# EAGLE design 1ChAmp_circuit_TH (EAGLE 7.3.0)
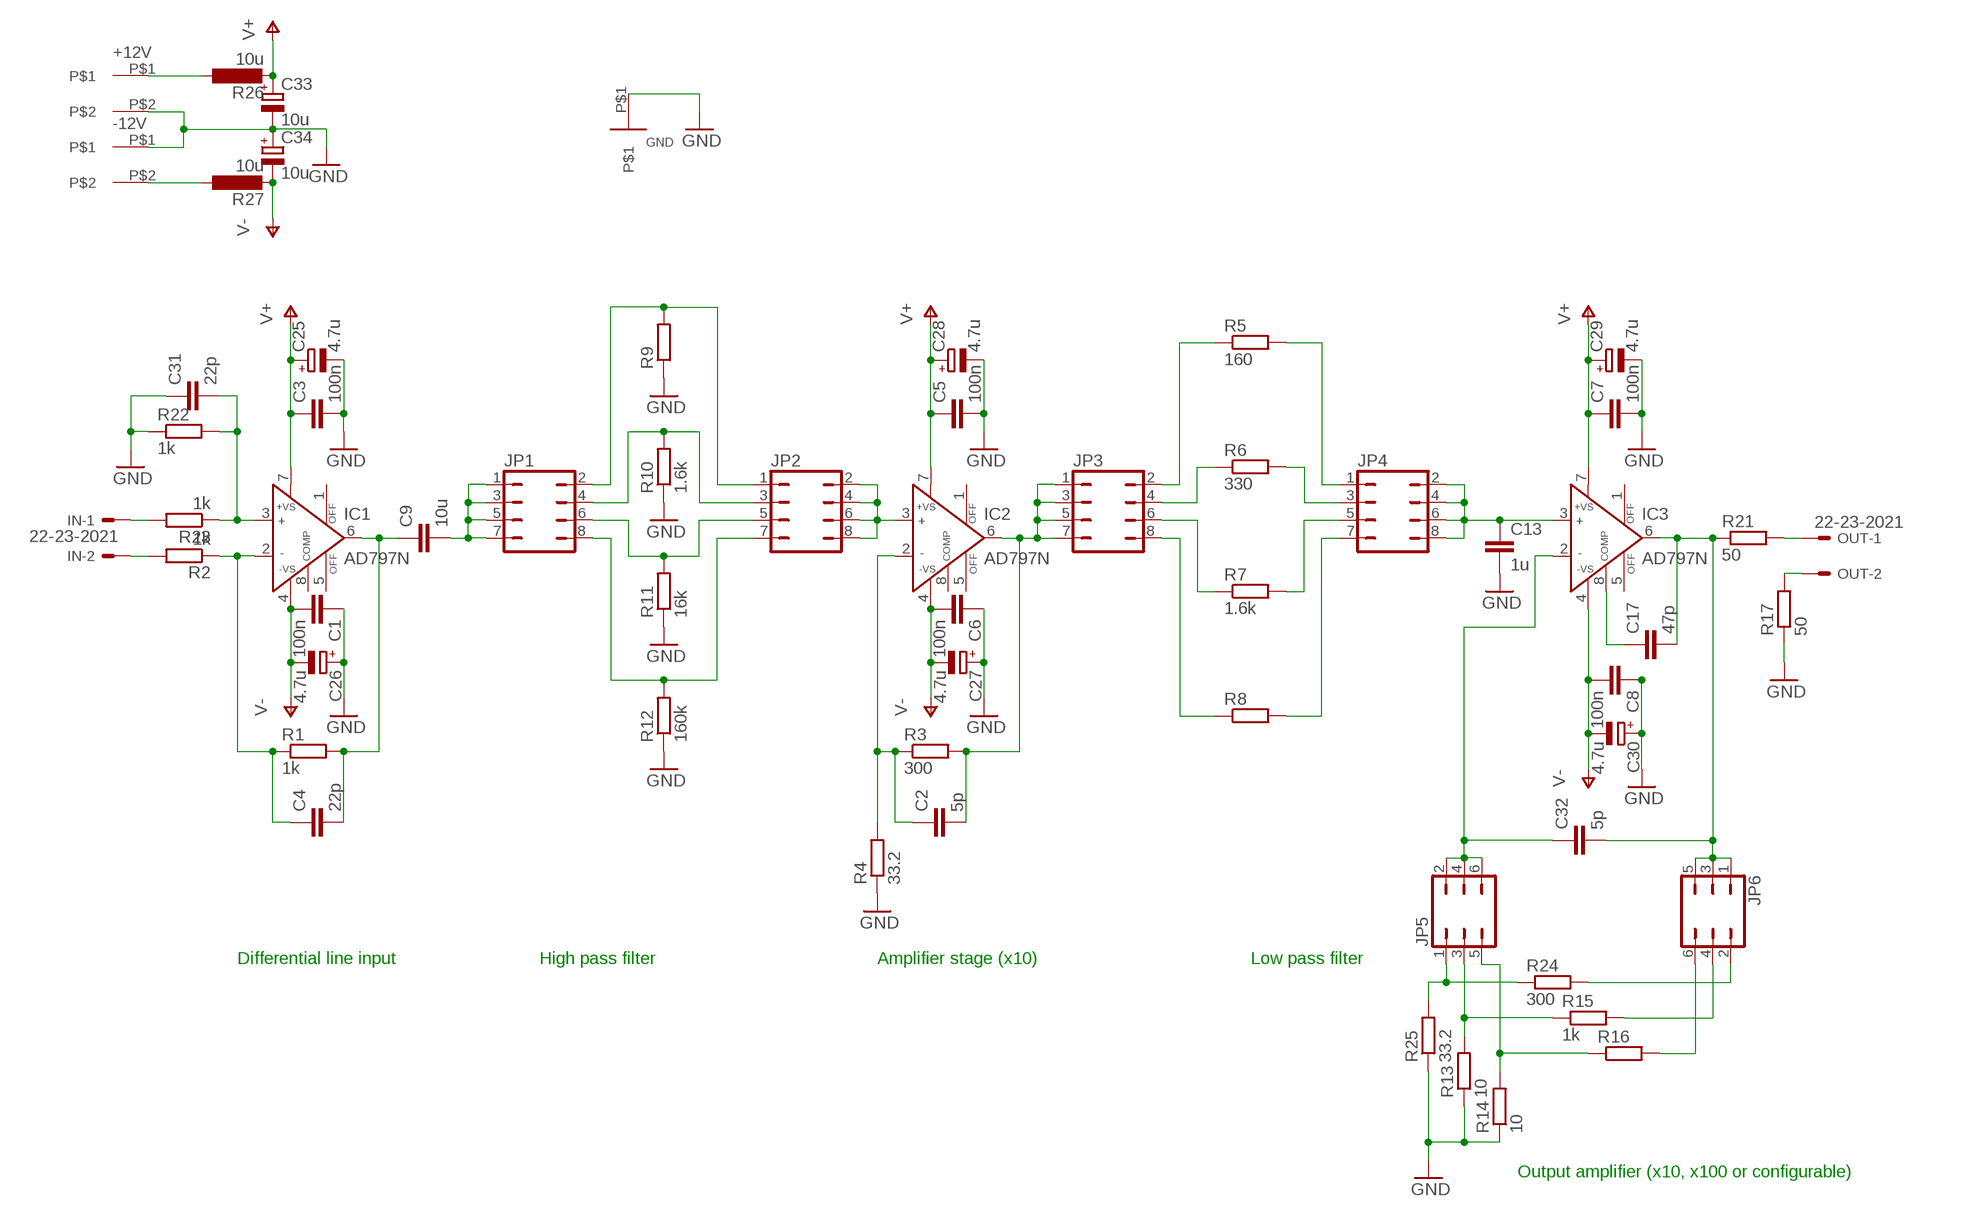
[diagram p0: schematic, sheet 1]

## Parts
+12V  B2P-VH  [B2P-VH]
-12V  B2P-VH  [B2P-VH]
C1  100n  C-EU025-025X050  [C025-025X050]
C2  5p  C-EU025-025X050  [C025-025X050]
C3  100n  C-EU025-025X050  [C025-025X050]
C4  22p  C-EU025-025X050  [C025-025X050]
C5  100n  C-EU025-025X050  [C025-025X050]
C6  100n  C-EU025-025X050  [C025-025X050]
C7  100n  C-EU025-025X050  [C025-025X050]
C8  100n  C-EU025-025X050  [C025-025X050]
C9  10u  C-EU150-091X182  [C150-091X182]
C13  1u  C-EU025-025X050  [C025-025X050]
C17  47p  C-EU025-025X050  [C025-025X050]
C25  4.7u  CPOL-EUB45181A  [B45181A]
C26  4.7u  CPOL-EUB45181A  [B45181A]
C27  4.7u  CPOL-EUB45181A  [B45181A]
C28  4.7u  CPOL-EUB45181A  [B45181A]
C29  4.7u  CPOL-EUB45181A  [B45181A]
C30  4.7u  CPOL-EUB45181A  [B45181A]
C31  22p  C-EU025-025X050  [C025-025X050]
C32  5p  C-EU050-025X075  [C050-025X075]
C33  10u  CPOL-EUB45181A  [B45181A]
C34  10u  CPOL-EUB45181A  [B45181A]
GND  GND_CONNECTOR  [GND_CONNECTOR]
IC1  AD797N  [DIL08]
IC2  AD797N  [DIL08]
IC3  AD797N  [DIL08]
IN  22-23-2021  [22-23-2021]
JP1  JP4Q  [JP4Q]
JP2  JP4Q  [JP4Q]
JP3  JP4Q  [JP4Q]
JP4  JP4Q  [JP4Q]
JP5  JP3Q  [JP3Q]
JP6  JP3Q  [JP3Q]
OUT  22-23-2021  [22-23-2021]
R1  1k  R-EU_0204/5  [0204/5]
R2  1k  R-EU_0204/5  [0204/5]
R3  300  R-EU_0204/5  [0204/5]
R4  33.2  R-EU_0204/5  [0204/5]
R5  160  R-EU_0204/5  [0204/5]
R6  330  R-EU_0204/5  [0204/5]
R7  1.6k  R-EU_0204/5  [0204/5]
R8  R-EU_0204/5  [0204/5]
R9  R-EU_0204/5  [0204/5]
R10  1.6k  R-EU_0204/5  [0204/5]
R11  16k  R-EU_0204/5  [0204/5]
R12  160k  R-EU_0204/5  [0204/5]
R13  10  R-EU_0204/5  [0204/5]
R14  10  R-EU_0204/5  [0204/5]
R15  1k  R-EU_0204/5  [0204/5]
R16  R-EU_0204/5  [0204/5]
R17  50  R-EU_0204/5  [0204/5]
R21  50  R-EU_0204/5  [0204/5]
R22  1k  R-EU_0204/5  [0204/5]
R23  1k  R-EU_0204/5  [0204/5]
R24  300  R-EU_0204/5  [0204/5]
R25  33.2  R-EU_0204/5  [0204/5]
R26  10u  L-EU  [RFS1113]
R27  10u  L-EU  [RFS1113]

## Nets
GND: +12V.P$2 -12V.P$1 C1.1 C3.2 C5.2 C6.1 C7.2 C8.1 C13.2 C25.- C26.+ C27.+ C28.- C29.- C30.+ C31.1 C33.- C34.+ GND.P$1 R4.1 R9.1 R10.1 R11.1 R12.1 R13.1 R14.1 R17.1 R22.1 R25.1
N$1: IN.2 R2.2
N$2: OUT.1 R21.2
N$3: IN.1 R23.2
N$4: C31.2 IC1.3(IN+) R22.2 R23.1
N$5: JP5.5 R14.2 R16.1
N$6: JP4.1 R5.2
N$7: C4.1 IC1.2(IN-) R1.1 R2.1
N$8: C4.2 C9.1 IC1.6(OUT) R1.2
N$9: C2.1 IC2.2(IN-) R3.1 R4.2
N$10: C2.2 IC2.6(OUT) JP3.1 JP3.3 JP3.5 JP3.7 R3.2
N$11: JP4.3 R6.2
N$12: C17.1 IC3.8(COMP)
N$13: JP4.5 R7.2
N$14: C17.2 C32.2 IC3.6(OUT) JP6.1 JP6.3 JP6.5 R21.1
N$15: +12V.P$1 R26.P$1
N$16: JP4.7 R8.2
N$17: JP5.3 R13.2 R15.1
N$18: OUT.2 R17.2
N$19: JP5.1 R24.1 R25.2
N$21: JP6.2 R24.2
N$23: JP6.4 R15.2
N$25: JP6.6 R16.2
N$26: C32.1 IC3.2(IN-) JP5.2 JP5.4 JP5.6
N$28: C9.2 JP1.1 JP1.3 JP1.5 JP1.7
N$29: JP1.4 JP2.3 R10.2
N$30: JP1.6 JP2.5 R11.2
N$31: JP1.8 JP2.7 R12.2
N$32: IC2.3(IN+) JP2.2 JP2.4 JP2.6 JP2.8
N$33: JP3.2 R5.1
N$34: JP3.4 R6.1
N$35: JP3.6 R7.1
N$36: JP3.8 R8.1
N$37: C13.1 IC3.3(IN+) JP4.2 JP4.4 JP4.6 JP4.8
N$38: JP1.2 JP2.1 R9.2
N$40: -12V.P$2 R27.P$1
V+: C3.1 C5.1 C7.1 C25.+ C28.+ C29.+ C33.+ IC1.7(+VS) IC2.7(+VS) IC3.7(+VS) R26.P$2
V-: C1.2 C6.2 C8.2 C26.- C27.- C30.- C34.- IC1.4(-VS) IC2.4(-VS) IC3.4(-VS) R27.P$2
Unconnected: IC1.1(OFF) IC1.5(OFF) IC1.8(COMP) IC2.1(OFF) IC2.5(OFF) IC2.8(COMP) IC3.1(OFF) IC3.5(OFF)

## Notes on the sheet
- Differential line input | High pass filter | Amplifier stage (x10) | Low pass filter
- Output amplifier (x10, x100 or configurable)

## Library data of the parts
+12V -12V = con-jst:B2P-VH: 2pin connector with 3.96mm pitch
C1-C9 C13 C17 C31 C32 = rcl:C-EU: CAPACITOR, European symbol
C25-C30 C33 C34 = rcl:CPOL-EU: POLARIZED CAPACITOR, European symbol
GND = jumper:GND_CONNECTOR: Connection pad to GND; 0.8 mm hole
IC1-IC3 = analog-devices:AD797: Ultralow Distortion, Ultralow Noise Op Amp Source: http://www.analog.com/static/imported-files/data_sheets/AD797.pdf; MF: ALTERA CORPORATION; MPN: AD797ANZ; OC_FARNELL: 9603778; OC_NEWARK: 59K6088
IN OUT = con-molex:22-23-2021: .100" (2.54mm) Center Header - 2 Pin; MF: MOLEX; MPN: 22-23-2021; OC_FARNELL: 1462926; OC_NEWARK: 25C3832
JP1-JP4 = jumper:JP4Q: JUMPER
JP5 JP6 = jumper:JP3Q: JUMPER
R1-R7 R9-R17 R21-R25 = rcl:R-EU_: RESISTOR, European symbol
R8 = resistor:R-EU_: RESISTOR, European symbol
R26 R27 = rcl:L-EU: INDUCTOR, European symbol

## Board
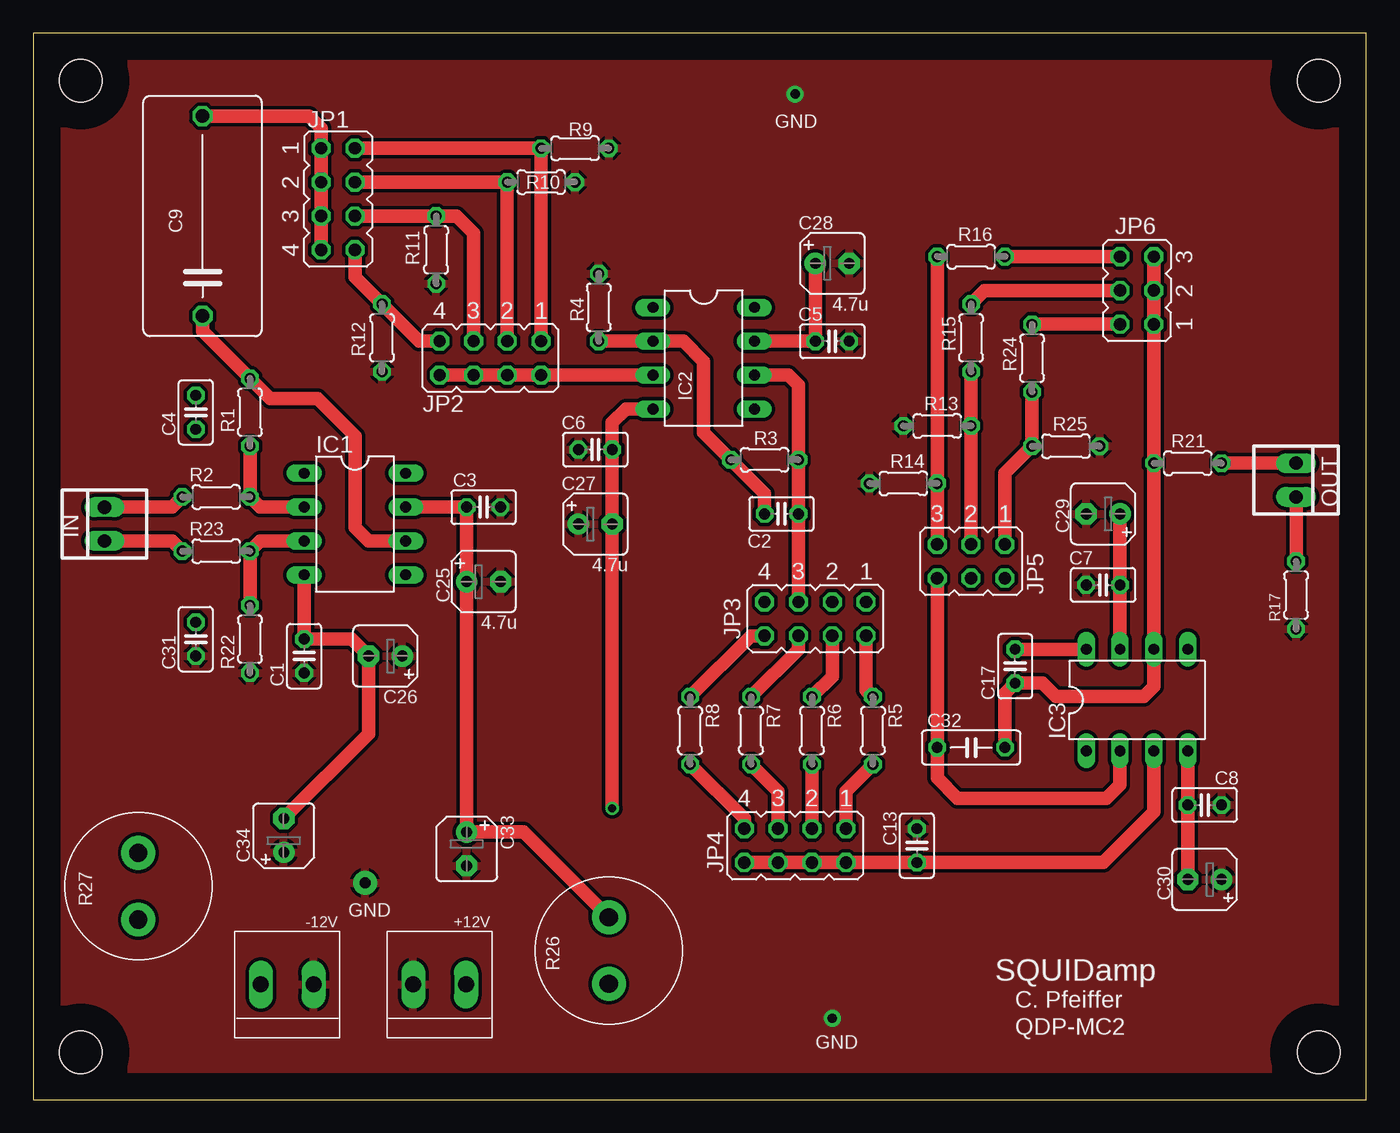
[diagram p1: board, top side]
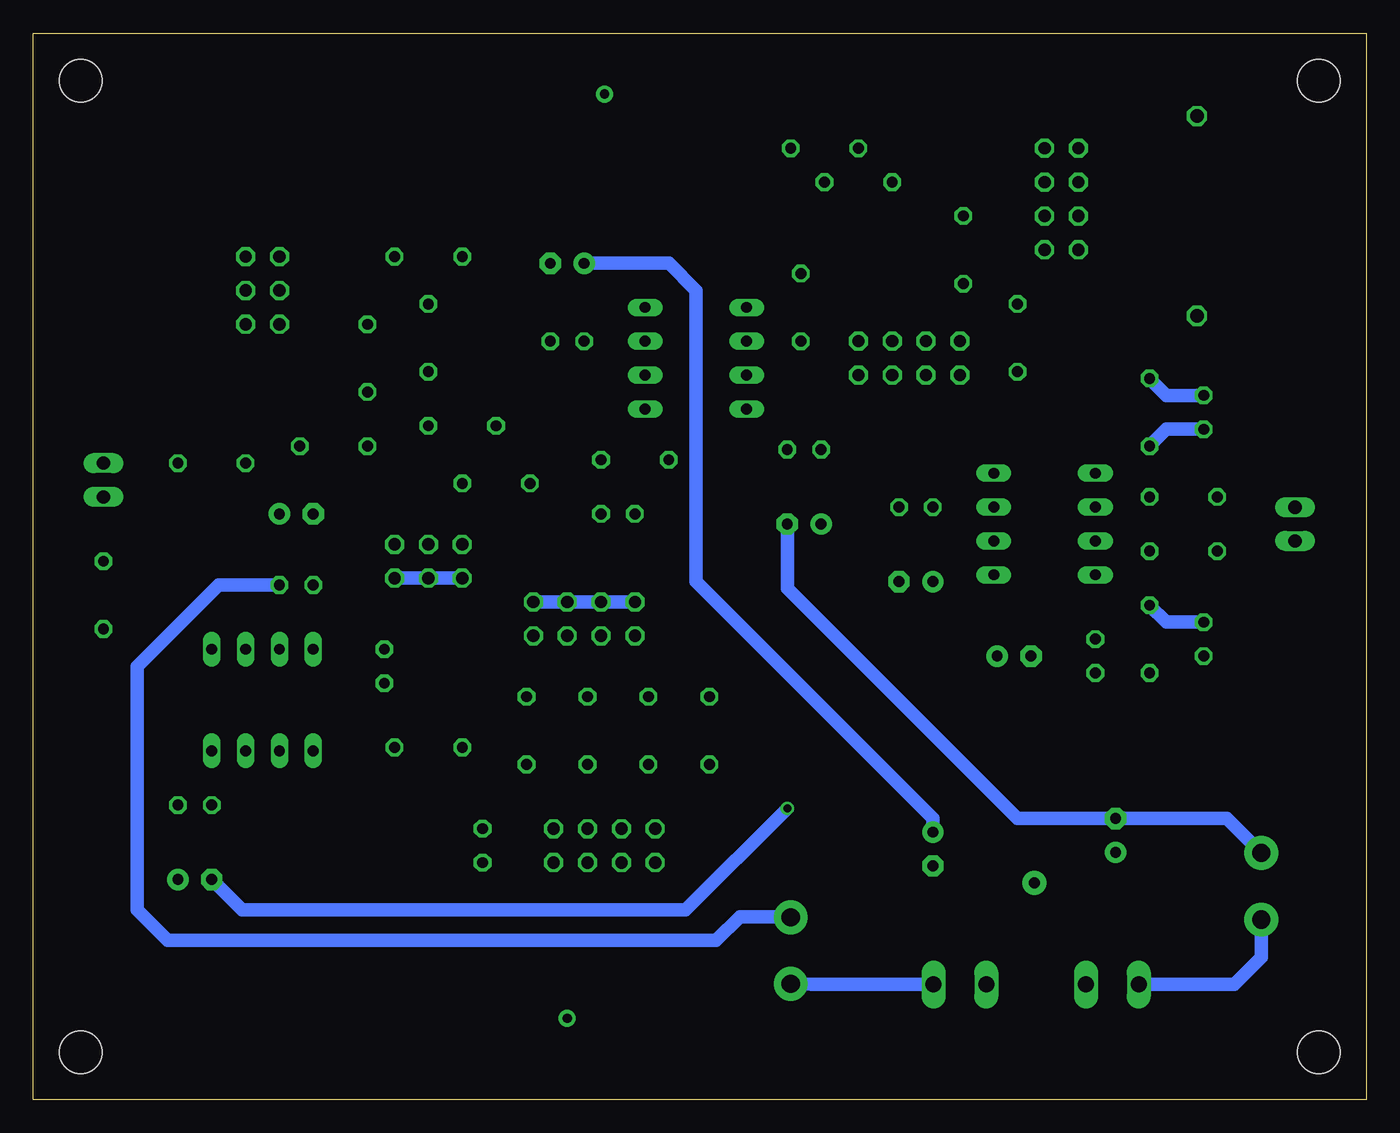
[diagram p2: board, bottom side, seen from below]

Size 100 x 80 mm. Coordinates in mm from the lower left corner, seen from the top.
Outline: 0,0 100,0 100,80 0,80 0,0
Copper layers (1*16): Top 0.035mm / dielectric 1.5mm / Bottom 0.035mm
Design rules "default *": minimum track width 6mil, minimum drill 12mil, track to track 6mil, track to pad 6mil, pad to pad 6mil, via to via 6mil, smd to smd 6mil, copper to edge 80mil, drill to drill 50mil, minimum pad ring 10mil, minimum via ring 8mil, stop-mask expansion 4mil, vias tented up to drill 0mil, thermal gap 10mil
Holes 3.2 mm at 3.56,3.56 3.56,76.44 96.44,3.56 96.44,76.44

### Footprints (pad centres in the part's own frame; a part is rotated, then mirrored left to right if it is on the bottom)
B2P-VH = drill 1.2 long: P$1 -1.98,0; P$2 1.98,0
C025-025X050 = drill 0.813 octagon: 1 -1.27,0; 2 1.27,0
C150-091X182 = drill 1.016 octagon: 1 -7.493,0; 2 7.493,0
B45181A = drill 0.813 pad 1.6: + -1.27,0 | drill 0.813 pad 1.6 octagon: - 1.27,0
C050-025X075 = drill 0.813 octagon: 1 -2.54,0; 2 2.54,0
GND_CONNECTOR = drill 0.8 pad 1.778: P$1 0,0
DIL08 = drill 0.813 long: 1 -3.81,-3.81; 2 -1.27,-3.81; 3 1.27,-3.81; 4 3.81,-3.81; 5 3.81,3.81; 6 1.27,3.81; 7 -1.27,3.81; 8 -3.81,3.81
22-23-2021 = drill 1 long: 1 -1.27,0; 2 1.27,0
JP4Q = drill 0.914 octagon: 1 -3.81,-1.27; 2 -3.81,1.27; 3 -1.27,-1.27; 4 -1.27,1.27; 5 1.27,-1.27; 6 1.27,1.27; 7 3.81,-1.27; 8 3.81,1.27
JP3Q = drill 0.914 octagon: 1 -2.54,-1.27; 2 -2.54,1.27; 3 0,-1.27; 4 0,1.27; 5 2.54,-1.27; 6 2.54,1.27
0204/5 = drill 0.813 octagon: 1 -2.54,0; 2 2.54,0
RFS1113 = drill 1.37 pad 2.54: P$1 -2.5,0; P$2 2.5,0

### Placement (x,y rotation side)
+12V  30.48,8.64 180 top
-12V  19.05,8.64 180 top
C1  20.32,33.27 90 top
C2  56.13,43.94 0 top
C3  33.78,44.45 0 top
C4  12.19,51.56 90 top
C5  59.94,56.9 0 top
C6  42.16,48.77 0 top
C7  80.26,38.61 180 top
C8  87.88,22.1 180 top
C9  12.7,66.29 90 top
C13  66.29,19.05 90 top
C17  73.66,32.51 270 top
C25  33.78,38.86 0 top
C26  26.42,33.27 180 top
C27  42.16,43.18 0 top
C28  59.94,62.74 0 top
C29  80.26,43.94 180 top
C30  87.88,16.51 180 top
C31  12.19,34.54 90 top
C32  70.36,26.42 0 top
C33  32.51,18.8 270 top
C34  18.8,19.81 90 top
GND  24.89,16.26 0 top
IC1  24.13,43.18 270 top
IC2  50.29,55.63 270 top
IC3  82.8,29.97 0 top
IN  5.33,43.18 90 top
JP1  22.86,67.56 270 top
JP2  34.29,55.63 180 top
JP3  58.67,36.07 180 top
JP4  57.15,19.05 180 top
JP5  70.36,40.39 180 top
JP6  82.8,60.71 90 top
OUT  94.74,46.48 270 top
R1  16.26,51.56 90 top
R2  13.72,45.21 180 top
R3  54.86,48.01 0 top
R4  42.42,59.44 270 top
R5  62.99,27.69 270 top
R6  58.42,27.69 270 top
R7  53.85,27.69 270 top
R8  49.28,27.69 270 top
R9  40.64,71.37 180 top
R10  38.1,68.83 180 top
R11  30.23,63.75 90 top
R12  26.16,57.15 90 top
R13  67.82,50.55 0 top
R14  65.28,46.23 0 top
R15  70.36,57.15 90 top
R16  70.36,63.25 0 top
R17  94.74,37.85 90 top
R21  86.61,47.75 0 top
R22  16.26,34.54 90 top
R23  13.72,41.15 180 top
R24  74.93,55.63 90 top
R25  77.47,49.02 180 top
R26  43.18,11.18 90 top
R27  7.87,16 90 top

### Tracks (layer width: path | path; a pad name or v marks a point on that pad's centre or on a via)
GND  (via drill 0.7 pad 1.27)
  other vias: 57.15,75.44 59.94,6.1
  pour Top (isolate 0.254): 0,80 0,0 100,0 100,80
N$1
  Top 1.016: R2.2 10.41,44.45 IN.2
N$2
  Top 1.016: R21.2 OUT.1
N$3
  Top 1.016: R23.2 10.41,41.91 IN.1
N$4
  Top 1.016: IC1.3 17.02,41.91 R23.1 R22.2
  Bottom 1.016: R22.2 14.99,35.81 C31.2
N$5
  Top 1.016: JP5.5 R14.2 R16.1
N$6
  Top 1.016: JP4.1 60.96,23.11 R5.2
N$7
  Top 1.016: IC1.2 17.02,44.45 R2.1 R1.1
  Bottom 1.016: R1.1 14.99,50.29 C4.1
N$8
  Top 1.016: IC1.6 25.15,41.91 24.13,42.93 24.13,49.78 21.34,52.58 17.78,52.58 R1.2 12.7,57.66 C9.1
  Bottom 1.016: R1.2 14.99,52.83 C4.2
N$9
  Top 1.016: R4.2 IC2.2 48.77,56.9 50.29,55.37 50.29,50.04 R3.1 54.86,45.47 C2.1
N$10
  Top 1.016: IC2.6 56.64,54.36 57.4,53.59 R3.2 C2.2 JP3.5
  Bottom 1.016: JP3.7 JP3.5 JP3.3 JP3.1
N$11
  Top 1.016: JP4.3 R6.2
N$12
  Top 1.016: C17.1 IC3.8
N$13
  Top 1.016: JP4.5 55.88,23.11 R7.2
N$14
  Top 1.016: C32.2 72.9,30.48 C17.2 75.69,31.24 76.71,30.23 83.31,30.23 84.07,30.99 IC3.6 R21.1 JP6.1 JP6.3 JP6.5
N$15
  Bottom 1.016: +12V.P$1 41.62,8.64 R26.P$1
N$16
  Top 1.016: JP4.7 53.34,21.08 R8.2
N$17
  Top 1.016: JP5.3 R13.2 R15.1
N$18
  Top 1.016: R17.2 OUT.2
N$19
  Top 1.016: JP5.1 72.9,46.99 R25.2 R24.1
N$21
  Top 1.016: R24.2 JP6.2
N$23
  Top 1.016: JP6.4 71.37,60.71 R15.2
N$25
  Top 1.016: R16.2 JP6.6
N$26
  Top 1.016: IC3.2 81.53,23.62 80.52,22.61 69.34,22.61 67.82,24.13 C32.1 JP5.6
  Bottom 1.016: JP5.6 JP5.4 JP5.2
N$28
  Top 0.813: 21.46,71.5 JP1.1
  Top 1.016: JP1.7 JP1.5 JP1.3 JP1.1 21.59,72.9 20.7,73.79 C9.2
N$29
  Top 1.016: JP1.4 R10.2 JP2.3
N$30
  Top 1.016: JP1.6 R11.2 31.75,66.29 33.02,65.02 JP2.5
N$31
  Top 1.016: JP1.8 24.13,61.72 R12.2 28.96,56.9 JP2.7
N$32
  Top 1.016: JP2.8 JP2.6 JP2.4 JP2.2 IC2.3
N$33
  Top 1.016: JP3.2 62.48,30.73 R5.1
N$34
  Top 1.016: JP3.4 59.94,31.75 R6.1
N$35
  Top 1.016: JP3.6 57.4,33.78 R7.1
N$36
  Top 1.016: JP3.8 53.85,34.8 R8.1
N$37
  Top 1.016: JP4.8 JP4.6 JP4.4 JP4.2 C13.1 80.26,17.78 84.07,21.59 IC3.3
N$38
  Top 1.016: JP1.2 R9.2 JP2.1
N$40
  Bottom 1.016: R27.P$1 7.87,10.67 9.91,8.64 -12V.P$2
V+
  Top 1.016: IC2.7 C5.1 C28.+ | IC3.7 C7.1 C29.+ | IC1.7 C3.1 C25.+ C33.+ 36.79,20.07 R26.P$2
  Bottom 1.016: C28.+ 52.32,62.74 50.29,60.71 50.29,38.86 32.51,21.08 C33.+ | R26.P$2 43.22,13.72 46.99,13.72 48.77,11.94 89.92,11.94 92.2,14.22 92.2,32.51 86.11,38.61 C7.1
V-  (via drill 0.6)
  Top 1.016: IC3.4 C8.2 C30.- | IC2.4 44.45,51.82 43.43,50.8 C6.2 C27.- v43.43,21.84 | IC1.4 C1.2 23.88,34.54 C26.- 25.15,27.43 C34.-
  Bottom 1.016: C30.- 84.33,14.22 51.05,14.22 v43.43,21.84 | C27.- 43.43,38.35 26.16,21.08 C34.- 10.45,21.08 R27.P$2

### Text on the board
tNames: GND | SQUIDamp | C. Pfeiffer | QDP-MC2 | GND
tValues: GND
Document: High pass: / 0.1-1-10-X Hz | Gain: / 10x(10-100-X) | Low pass: / X-100-500-1000 Hz